# Altium schematic sheet 05_FPGA Bank502.SchDoc
size 297 x 209 mm
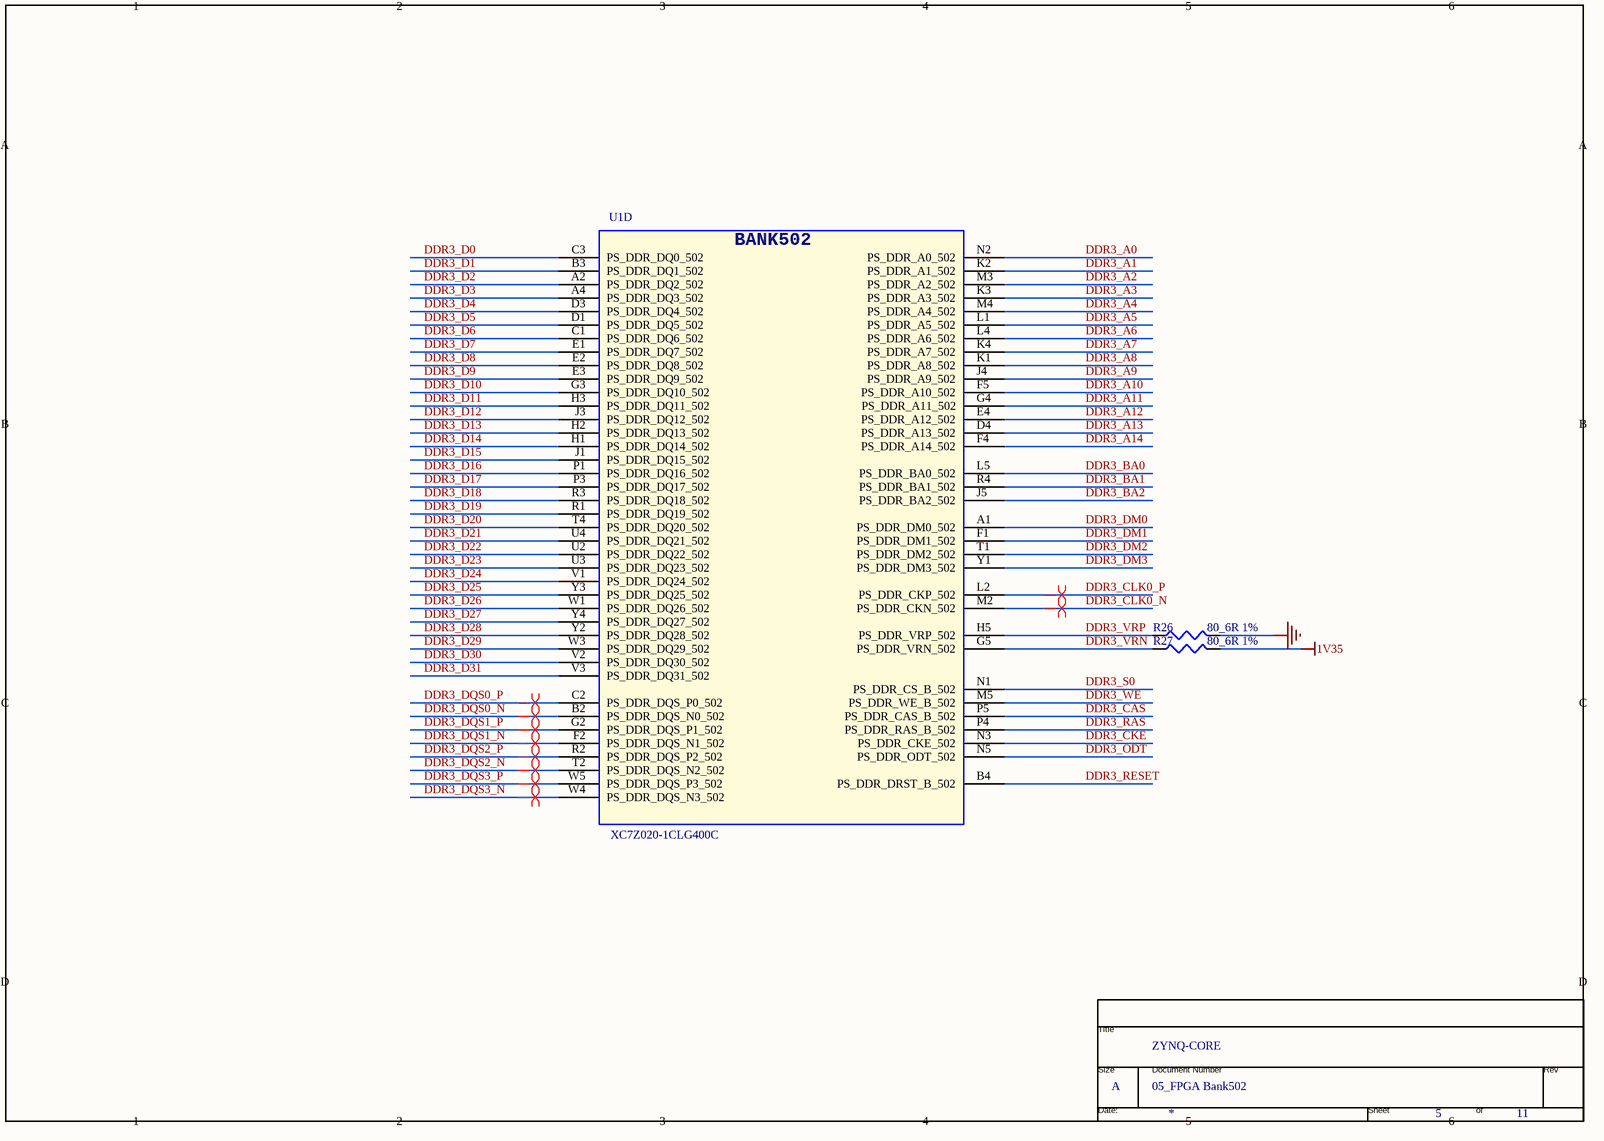
[diagram p0: 05_FPGA Bank502.SchDoc]

## Parts
*  Page Count: 11  Page Number: 5  Page Size: A  Title: ZYNQ-CORE  Doc: 05_FPGA Bank502  (hidden comment: TitleBlock0)  (graphical)
R26  80_6R 1%  [R0402A]
R27  80_6R 1%  [R0402A]
U1  XC7Z020-1CLG400C  [CLG400]  (part D of 9)

## Nets
1V35: R27.2
GND: R26.2
DDR3_A0: U1.N2(PS_DDR_A0_502)
DDR3_A1: U1.K2(PS_DDR_A1_502)
DDR3_A2: U1.M3(PS_DDR_A2_502)
DDR3_A3: U1.K3(PS_DDR_A3_502)
DDR3_A4: U1.M4(PS_DDR_A4_502)
DDR3_A5: U1.L1(PS_DDR_A5_502)
DDR3_A6: U1.L4(PS_DDR_A6_502)
DDR3_A7: U1.K4(PS_DDR_A7_502)
DDR3_A8: U1.K1(PS_DDR_A8_502)
DDR3_A9: U1.J4(PS_DDR_A9_502)
DDR3_A10: U1.F5(PS_DDR_A10_502)
DDR3_A11: U1.G4(PS_DDR_A11_502)
DDR3_A12: U1.E4(PS_DDR_A12_502)
DDR3_A13: U1.D4(PS_DDR_A13_502)
DDR3_A14: U1.F4(PS_DDR_A14_502)
DDR3_BA0: U1.L5(PS_DDR_BA0_502)
DDR3_BA1: U1.R4(PS_DDR_BA1_502)
DDR3_BA2: U1.J5(PS_DDR_BA2_502)
DDR3_CAS: U1.P5(PS_DDR_CAS_B_502)
DDR3_CKE: U1.N3(PS_DDR_CKE_502)
DDR3_CLK0_N: U1.M2(PS_DDR_CKN_502)
DDR3_CLK0_P: U1.L2(PS_DDR_CKP_502)
DDR3_D0: U1.C3(PS_DDR_DQ0_502)
DDR3_D1: U1.B3(PS_DDR_DQ1_502)
DDR3_D2: U1.A2(PS_DDR_DQ2_502)
DDR3_D3: U1.A4(PS_DDR_DQ3_502)
DDR3_D4: U1.D3(PS_DDR_DQ4_502)
DDR3_D5: U1.D1(PS_DDR_DQ5_502)
DDR3_D6: U1.C1(PS_DDR_DQ6_502)
DDR3_D7: U1.E1(PS_DDR_DQ7_502)
DDR3_D8: U1.E2(PS_DDR_DQ8_502)
DDR3_D9: U1.E3(PS_DDR_DQ9_502)
DDR3_D10: U1.G3(PS_DDR_DQ10_502)
DDR3_D11: U1.H3(PS_DDR_DQ11_502)
DDR3_D12: U1.J3(PS_DDR_DQ12_502)
DDR3_D13: U1.H2(PS_DDR_DQ13_502)
DDR3_D14: U1.H1(PS_DDR_DQ14_502)
DDR3_D15: U1.J1(PS_DDR_DQ15_502)
DDR3_D16: U1.P1(PS_DDR_DQ16_502)
DDR3_D17: U1.P3(PS_DDR_DQ17_502)
DDR3_D18: U1.R3(PS_DDR_DQ18_502)
DDR3_D19: U1.R1(PS_DDR_DQ19_502)
DDR3_D20: U1.T4(PS_DDR_DQ20_502)
DDR3_D21: U1.U4(PS_DDR_DQ21_502)
DDR3_D22: U1.U2(PS_DDR_DQ22_502)
DDR3_D23: U1.U3(PS_DDR_DQ23_502)
DDR3_D24: U1.V1(PS_DDR_DQ24_502)
DDR3_D25: U1.Y3(PS_DDR_DQ25_502)
DDR3_D26: U1.W1(PS_DDR_DQ26_502)
DDR3_D27: U1.Y4(PS_DDR_DQ27_502)
DDR3_D28: U1.Y2(PS_DDR_DQ28_502)
DDR3_D29: U1.W3(PS_DDR_DQ29_502)
DDR3_D30: U1.V2(PS_DDR_DQ30_502)
DDR3_D31: U1.V3(PS_DDR_DQ31_502)
DDR3_DM0: U1.A1(PS_DDR_DM0_502)
DDR3_DM1: U1.F1(PS_DDR_DM1_502)
DDR3_DM2: U1.T1(PS_DDR_DM2_502)
DDR3_DM3: U1.Y1(PS_DDR_DM3_502)
DDR3_DQS0_N: U1.B2(PS_DDR_DQS_N0_502)
DDR3_DQS0_P: U1.C2(PS_DDR_DQS_P0_502)
DDR3_DQS1_N: U1.F2(PS_DDR_DQS_N1_502)
DDR3_DQS1_P: U1.G2(PS_DDR_DQS_P1_502)
DDR3_DQS2_N: U1.T2(PS_DDR_DQS_N2_502)
DDR3_DQS2_P: U1.R2(PS_DDR_DQS_P2_502)
DDR3_DQS3_N: U1.W4(PS_DDR_DQS_N3_502)
DDR3_DQS3_P: U1.W5(PS_DDR_DQS_P3_502)
DDR3_ODT: U1.N5(PS_DDR_ODT_502)
DDR3_RAS: U1.P4(PS_DDR_RAS_B_502)
DDR3_RESET: U1.B4(PS_DDR_DRST_B_502)
DDR3_S0: U1.N1(PS_DDR_CS_B_502)
DDR3_VRN: R27.1 U1.G5(PS_DDR_VRN_502)
DDR3_VRP: R26.1 U1.H5(PS_DDR_VRP_502)
DDR3_WE: U1.M5(PS_DDR_WE_B_502)

## Layout directives
differential pair: DDR3_CLK0_N, DDR3_CLK0_P, DDR3_DQS0_N, DDR3_DQS0_P, DDR3_DQS1_N, DDR3_DQS1_P, DDR3_DQS2_N, DDR3_DQS2_P, DDR3_DQS3_N, DDR3_DQS3_P

## Notes on the sheet
- (in symbol TitleBlock0) Title; Size; Document Number; Rev; Date:; Sheet; of
- (in symbol Zynq7010/7020, part D) BANK502

## Library data of the parts
R26 R27 = RESISTOR_Dup1: PCB Footprint: R0402
U1 = Zynq7010/7020: PCB Footprint: CLG400
* = TitleBlock0: Page Create Date: March  8, 1995; Page Modify Date: *